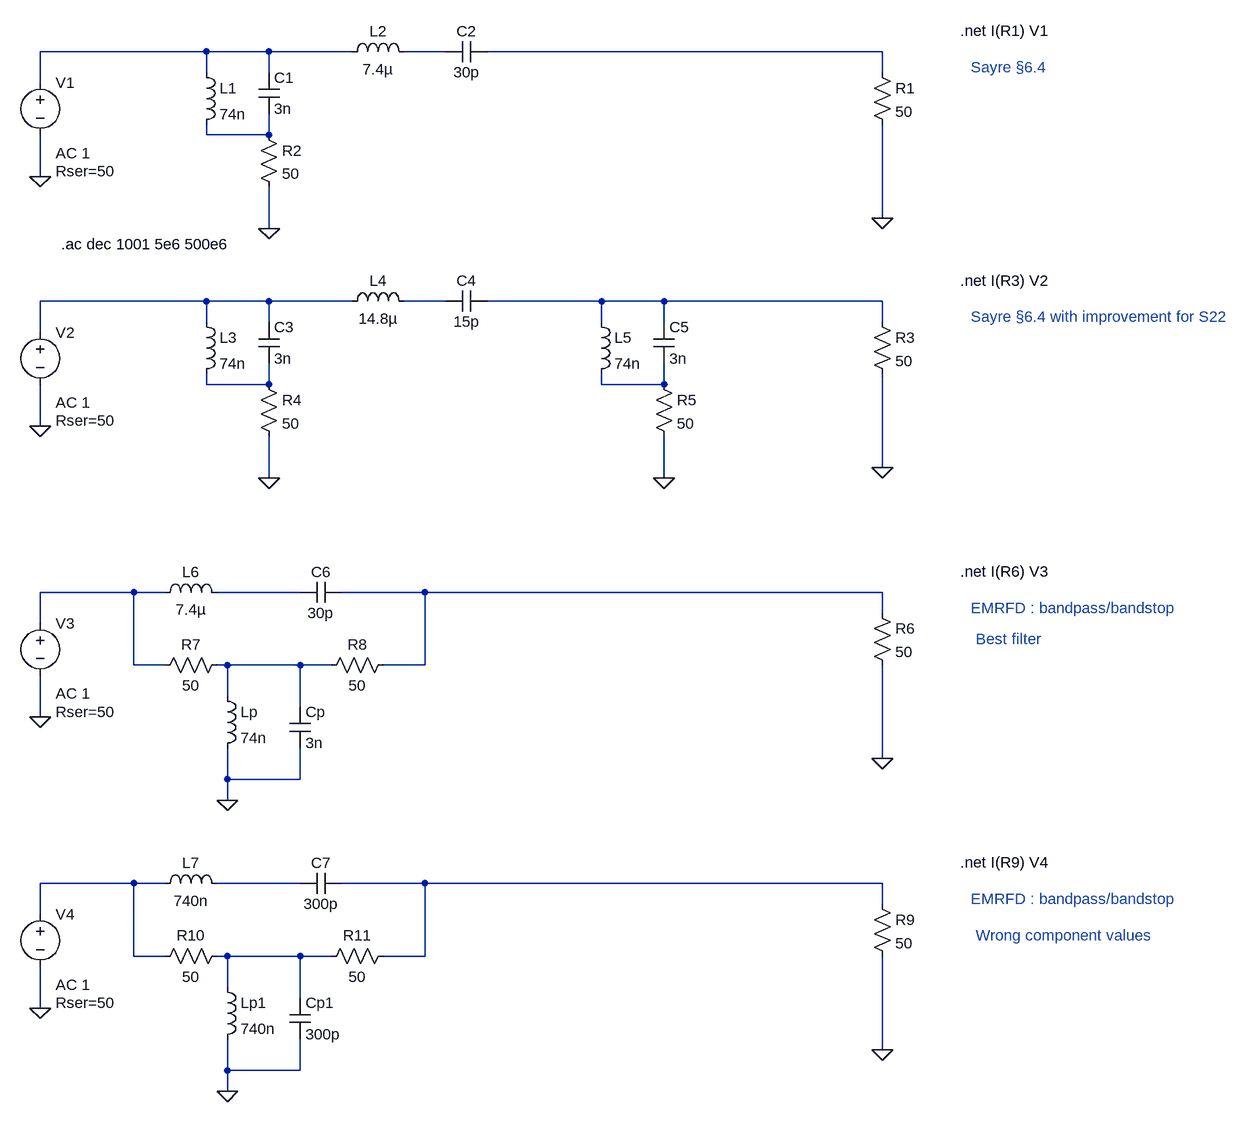
[diagram p0: schematic diplexer_IF.asc]
diplexer_IF.asc, the LTspice schematic file:
Version 4
SHEET 1 1920 2004
WIRE 176 64 -80 64
WIRE 272 64 176 64
WIRE 400 64 272 64
WIRE 544 64 480 64
WIRE 1216 64 608 64
WIRE 176 96 176 64
WIRE 272 96 272 64
WIRE 1216 96 1216 64
WIRE -80 112 -80 64
WIRE 176 192 176 176
WIRE 272 192 272 160
WIRE 272 192 176 192
WIRE -80 256 -80 192
WIRE 1216 320 1216 176
WIRE 272 336 272 272
WIRE 176 448 -80 448
WIRE 272 448 176 448
WIRE 400 448 272 448
WIRE 544 448 480 448
WIRE 784 448 608 448
WIRE 880 448 784 448
WIRE 1216 448 880 448
WIRE 176 480 176 448
WIRE 272 480 272 448
WIRE 784 480 784 448
WIRE 880 480 880 448
WIRE 1216 480 1216 448
WIRE -80 496 -80 448
WIRE 176 576 176 560
WIRE 272 576 272 544
WIRE 272 576 176 576
WIRE 784 576 784 560
WIRE 880 576 880 544
WIRE 880 576 784 576
WIRE -80 640 -80 576
WIRE 1216 704 1216 560
WIRE 272 720 272 656
WIRE 880 720 880 656
WIRE 64 896 -80 896
WIRE 112 896 64 896
WIRE 320 896 192 896
WIRE 512 896 384 896
WIRE 1216 896 512 896
WIRE 1216 928 1216 896
WIRE -80 944 -80 896
WIRE 64 1008 64 896
WIRE 112 1008 64 1008
WIRE 208 1008 192 1008
WIRE 320 1008 208 1008
WIRE 368 1008 320 1008
WIRE 512 1008 512 896
WIRE 512 1008 448 1008
WIRE 208 1056 208 1008
WIRE 320 1072 320 1008
WIRE -80 1088 -80 1024
WIRE 1216 1152 1216 1008
WIRE 208 1184 208 1136
WIRE 320 1184 320 1136
WIRE 320 1184 208 1184
WIRE 208 1216 208 1184
WIRE 64 1344 -80 1344
WIRE 112 1344 64 1344
WIRE 320 1344 192 1344
WIRE 512 1344 384 1344
WIRE 1216 1344 512 1344
WIRE 1216 1376 1216 1344
WIRE -80 1392 -80 1344
WIRE 64 1456 64 1344
WIRE 112 1456 64 1456
WIRE 208 1456 192 1456
WIRE 320 1456 208 1456
WIRE 368 1456 320 1456
WIRE 512 1456 512 1344
WIRE 512 1456 448 1456
WIRE 208 1504 208 1456
WIRE 320 1520 320 1456
WIRE -80 1536 -80 1472
WIRE 1216 1600 1216 1456
WIRE 208 1632 208 1584
WIRE 320 1632 320 1584
WIRE 320 1632 208 1632
WIRE 208 1664 208 1632
FLAG -80 256 0
FLAG 272 336 0
FLAG 1216 320 0
FLAG -80 640 0
FLAG 272 720 0
FLAG 1216 704 0
FLAG 880 720 0
FLAG -80 1088 0
FLAG 1216 1152 0
FLAG 208 1216 0
FLAG -80 1536 0
FLAG 1216 1600 0
FLAG 208 1664 0
SYMBOL voltage -80 96 R0
WINDOW 123 24 124 Left 2
WINDOW 39 24 152 Left 2
SYMATTR Value2 AC 1
SYMATTR SpiceLine Rser=50
SYMATTR InstName V1
SYMATTR Value ""
SYMBOL ind 160 80 R0
SYMATTR InstName L1
SYMATTR Value 74n
SYMBOL cap 256 96 R0
SYMATTR InstName C1
SYMATTR Value 3n
SYMBOL ind 384 80 R270
WINDOW 0 32 56 VTop 2
WINDOW 3 5 56 VBottom 2
SYMATTR InstName L2
SYMATTR Value 7.4µ
SYMBOL cap 608 48 R90
WINDOW 0 0 32 VBottom 2
WINDOW 3 32 32 VTop 2
SYMATTR InstName C2
SYMATTR Value 30p
SYMBOL res 1200 80 R0
SYMATTR InstName R1
SYMATTR Value 50
SYMBOL res 256 176 R0
SYMATTR InstName R2
SYMATTR Value 50
SYMBOL voltage -80 480 R0
WINDOW 123 24 124 Left 2
WINDOW 39 24 152 Left 2
SYMATTR Value2 AC 1
SYMATTR SpiceLine Rser=50
SYMATTR InstName V2
SYMATTR Value ""
SYMBOL ind 160 464 R0
SYMATTR InstName L3
SYMATTR Value 74n
SYMBOL cap 256 480 R0
SYMATTR InstName C3
SYMATTR Value 3n
SYMBOL ind 384 464 R270
WINDOW 0 32 56 VTop 2
WINDOW 3 5 56 VBottom 2
SYMATTR InstName L4
SYMATTR Value 14.8µ
SYMBOL cap 608 432 R90
WINDOW 0 0 32 VBottom 2
WINDOW 3 32 32 VTop 2
SYMATTR InstName C4
SYMATTR Value 15p
SYMBOL res 1200 464 R0
SYMATTR InstName R3
SYMATTR Value 50
SYMBOL res 256 560 R0
SYMATTR InstName R4
SYMATTR Value 50
SYMBOL ind 768 464 R0
SYMATTR InstName L5
SYMATTR Value 74n
SYMBOL cap 864 480 R0
SYMATTR InstName C5
SYMATTR Value 3n
SYMBOL res 864 560 R0
SYMATTR InstName R5
SYMATTR Value 50
SYMBOL voltage -80 928 R0
WINDOW 123 24 124 Left 2
WINDOW 39 24 152 Left 2
SYMATTR Value2 AC 1
SYMATTR SpiceLine Rser=50
SYMATTR InstName V3
SYMATTR Value ""
SYMBOL res 1200 912 R0
SYMATTR InstName R6
SYMATTR Value 50
SYMBOL ind 96 912 R270
WINDOW 0 32 56 VTop 2
WINDOW 3 5 56 VBottom 2
SYMATTR InstName L6
SYMATTR Value 7.4µ
SYMBOL cap 384 880 R90
WINDOW 0 0 32 VBottom 2
WINDOW 3 32 32 VTop 2
SYMATTR InstName C6
SYMATTR Value 30p
SYMBOL res 208 992 R90
WINDOW 0 0 56 VBottom 2
WINDOW 3 32 56 VTop 2
SYMATTR InstName R7
SYMATTR Value 50
SYMBOL res 464 992 R90
WINDOW 0 0 56 VBottom 2
WINDOW 3 32 56 VTop 2
SYMATTR InstName R8
SYMATTR Value 50
SYMBOL ind 192 1040 R0
SYMATTR InstName Lp
SYMATTR Value 74n
SYMBOL cap 304 1072 R0
SYMATTR InstName Cp
SYMATTR Value 3n
SYMBOL voltage -80 1376 R0
WINDOW 123 24 124 Left 2
WINDOW 39 24 152 Left 2
SYMATTR Value2 AC 1
SYMATTR SpiceLine Rser=50
SYMATTR InstName V4
SYMATTR Value ""
SYMBOL res 1200 1360 R0
SYMATTR InstName R9
SYMATTR Value 50
SYMBOL ind 96 1360 R270
WINDOW 0 32 56 VTop 2
WINDOW 3 5 56 VBottom 2
SYMATTR InstName L7
SYMATTR Value 740n
SYMBOL cap 384 1328 R90
WINDOW 0 0 32 VBottom 2
WINDOW 3 32 32 VTop 2
SYMATTR InstName C7
SYMATTR Value 300p
SYMBOL res 208 1440 R90
WINDOW 0 0 56 VBottom 2
WINDOW 3 32 56 VTop 2
SYMATTR InstName R10
SYMATTR Value 50
SYMBOL res 464 1440 R90
WINDOW 0 0 56 VBottom 2
WINDOW 3 32 56 VTop 2
SYMATTR InstName R11
SYMATTR Value 50
SYMBOL ind 192 1488 R0
SYMATTR InstName Lp1
SYMATTR Value 740n
SYMBOL cap 304 1520 R0
SYMATTR InstName Cp1
SYMATTR Value 300p
TEXT -48 360 Left 2 !.ac dec 1001 5e6 500e6
TEXT 1336 32 Left 2 !.net I(R1) V1
TEXT 1352 88 Left 2 ;Sayre §6.4
TEXT 1336 416 Left 2 !.net I(R3) V2
TEXT 1352 472 Left 2 ;Sayre §6.4 with improvement for S22
TEXT 1336 864 Left 2 !.net I(R6) V3
TEXT 1352 920 Left 2 ;EMRFD : bandpass/bandstop
TEXT 1336 1312 Left 2 !.net I(R9) V4
TEXT 1352 1368 Left 2 ;EMRFD : bandpass/bandstop
TEXT 1360 1424 Left 2 ;Wrong component values
TEXT 1360 968 Left 2 ;Best filter

The netlist it stands for:
* diplexer_IF.asc
V1 N001 0 AC 1 Rser=50
L1 N001 N004 74n
C1 N001 N004 3n
L2 N001 N002 7.4µ
C2 N003 N002 30p
R1 N003 0 50
R2 N004 0 50
V2 N005 0 AC 1 Rser=50
L3 N005 N008 74n
C3 N005 N008 3n
L4 N005 N006 14.8µ
C4 N007 N006 15p
R3 N007 0 50
R4 N008 0 50
L5 N007 N009 74n
C5 N007 N009 3n
R5 N009 0 50
V3 N010 0 AC 1 Rser=50
R6 N012 0 50
L6 N010 N011 7.4µ
C6 N012 N011 30p
R7 N013 N010 50
R8 N012 N013 50
Lp N013 0 74n
Cp N013 0 3n
V4 N014 0 AC 1 Rser=50
R9 N016 0 50
L7 N014 N015 740n
C7 N016 N015 300p
R10 N017 N014 50
R11 N016 N017 50
Lp1 N017 0 740n
Cp1 N017 0 300p
.ac dec 1001 5e6 500e6
.net I(R1) V1
* Sayre §6.4
.net I(R3) V2
* Sayre §6.4 with improvement for S22
.net I(R6) V3
* EMRFD : bandpass/bandstop
.net I(R9) V4
* EMRFD : bandpass/bandstop
* Wrong component values
* Best filter
.backanno
.end